# Altium schematic sheet Schema_9_relaiskaart.SchDoc
size A4; SheetNumber: 1; SheetTotal: 1
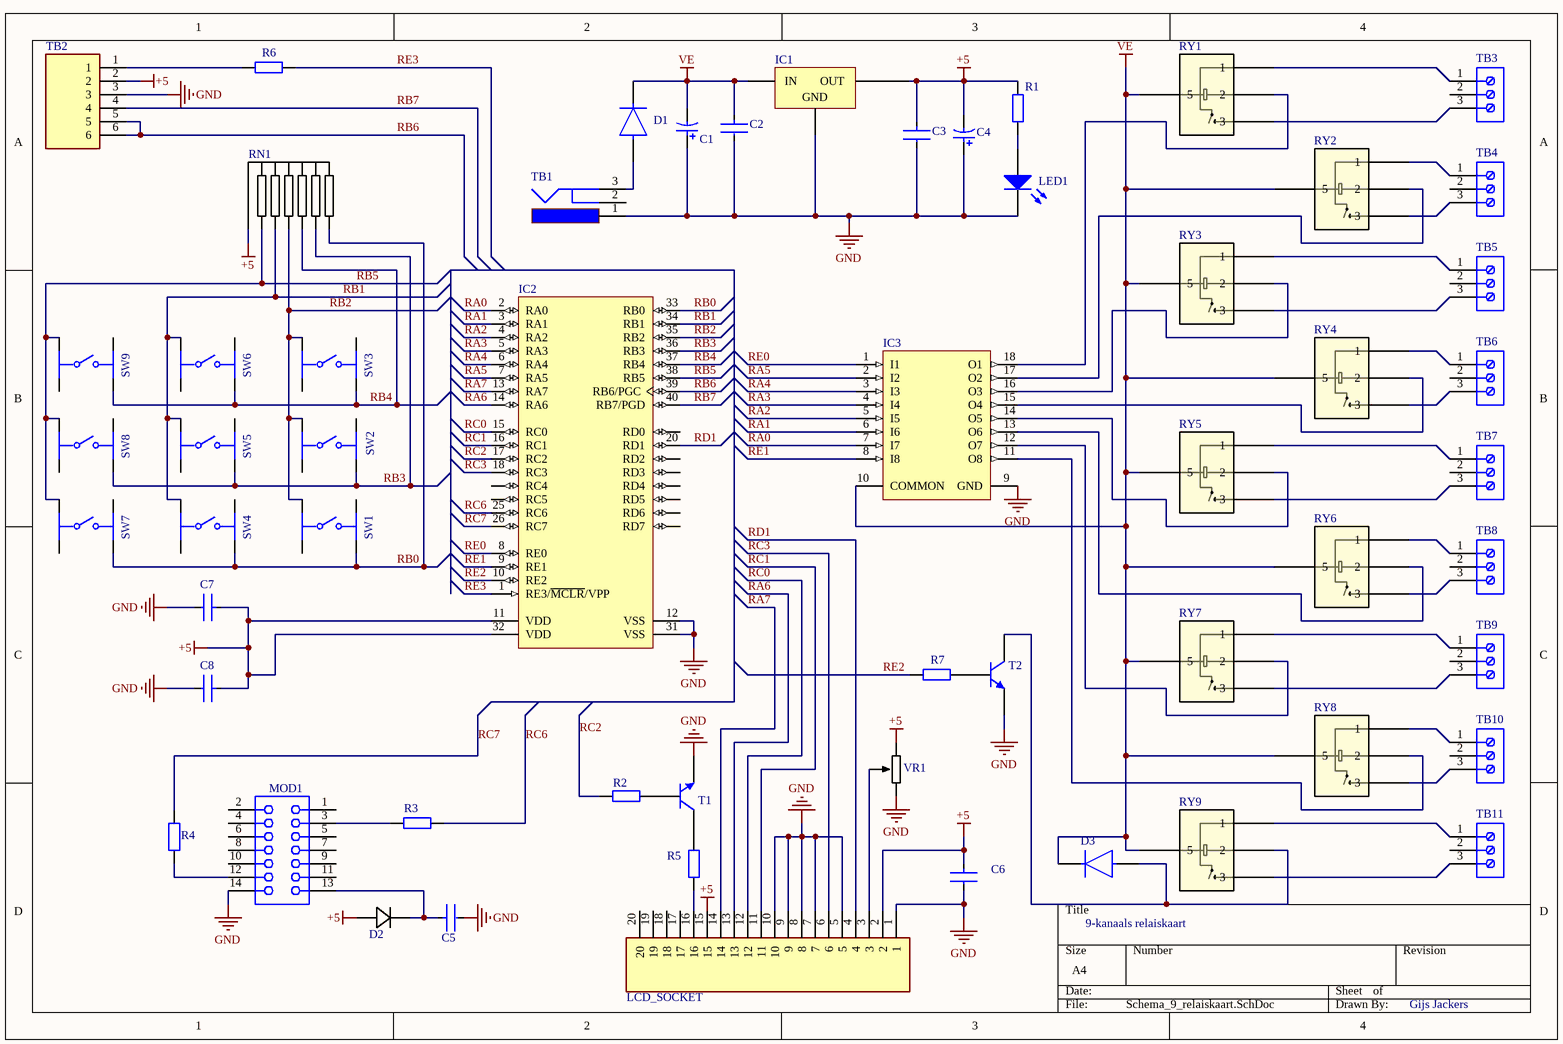
[diagram p0: Schema_9_relaiskaart.SchDoc]

## Parts
C1  ECA-1HM221  [CAPPR65-500-1250X1000X1350]  (value not drawn)
C2  SR205C104KAR  [FP-SR20-MFG]  (value not drawn)
C3  SR205C104KAR  [FP-SR20-MFG]  (value not drawn)
C4  ECA1HM101  [CAPPR65-350-1150X800X1250]  (value not drawn)
C5  SR205C104KAR  [FP-SR20-MFG]  (value not drawn)
C6  SR205C104KAR  [FP-SR20-MFG]  (value not drawn)
C7  SR205C104KAR  [FP-SR20-MFG]  (value not drawn)
C8  SR205C104KAR  [FP-SR20-MFG]  (value not drawn)
D1  1N4007  [FP-1N4007-MFG]  (value not drawn)
D2  BAT43  [DO-35_STM]  (value not drawn)
D3  1N4007  [FP-1N4007-MFG]  (value not drawn)
IC1  MC7805CTG  [ONSC-TO-220-3-221AB-01]  (value not drawn)
IC2  PIC18F45K22-E/P  [MCHP-PDIP-P40]  (value not drawn)
IC3  ULN2803A  [STM-DIP-18]  (value not drawn)
LCD_SOCKET  D01-9972042  [D019972042]  (value not drawn)
LED1  151031SS04000  [Type 3mm]  (value not drawn)
MOD1  ESQ-107-12-G-D  [DIP14]  (value not drawn)
R1  ERJ-8GEYJ331V  [RESC3216X70X50NL05T20]  (value not drawn)
R2  ERJ-8GEYJ472V  [RESC3216X70X50LL05T20]  (value not drawn)
R3  ERJ-8GEYJ102V  [RESC3216X70X50LL05T20]  (value not drawn)
R4  ERJ-8GEYJ102V  [RESC3216X70X50LL05T20]  (value not drawn)
R5  ERJ-8GEYJ4R7V  [RESC3216X70X50NL05T20]  (value not drawn)
R6  ERJ-8GEYJ100V  [RESC3216X70X50LL05T20]  (value not drawn)
R7  ERJ-8GEYJ472V  [RESC3216X70X50LL05T20]  (value not drawn)
RN1  4607X-101-103LF  [BO_4607X]  (value not drawn)
RY1  G5LE-1A-CF DC12  [RELAY_G5LE-1A DC5_OMR]  (value not drawn)
RY2  G5LE-1A-CF DC12  [RELAY_G5LE-1A DC5_OMR]  (value not drawn)
RY3  G5LE-1A-CF DC12  [RELAY_G5LE-1A DC5_OMR]  (value not drawn)
RY4  G5LE-1A-CF DC12  [RELAY_G5LE-1A DC5_OMR]  (value not drawn)
RY5  G5LE-1A-CF DC12  [RELAY_G5LE-1A DC5_OMR]  (value not drawn)
RY6  G5LE-1A-CF DC12  [RELAY_G5LE-1A DC5_OMR]  (value not drawn)
RY7  G5LE-1A-CF DC12  [RELAY_G5LE-1A DC5_OMR]  (value not drawn)
RY8  G5LE-1A-CF DC12  [RELAY_G5LE-1A DC5_OMR]  (value not drawn)
RY9  G5LE-1A-CF DC12  [RELAY_G5LE-1A DC5_OMR]  (value not drawn)
SW1  B3F-4000  [FP-B3F-4000-MFG]  (value not drawn)
SW2  B3F-4000  [FP-B3F-4000-MFG]  (value not drawn)
SW3  B3F-4000  [FP-B3F-4000-MFG]  (value not drawn)
SW4  B3F-4000  [FP-B3F-4000-MFG]  (value not drawn)
SW5  B3F-4000  [FP-B3F-4000-MFG]  (value not drawn)
SW6  B3F-4000  [FP-B3F-4000-MFG]  (value not drawn)
SW7  B3F-4000  [FP-B3F-4000-MFG]  (value not drawn)
SW8  B3F-4000  [FP-B3F-4000-MFG]  (value not drawn)
SW9  B3F-4000  [FP-B3F-4000-MFG]  (value not drawn)
T1  BC337-25ZL1G  [ONSC-TO-92-3-29-11_AM_BL]  (value not drawn)
T2  BC337-25ZL1G  [ONSC-TO-92-3-29-11_AM_BL]  (value not drawn)
TB1  Component_1  [MJ-180PH]  (value not drawn)
TB2  M20-7820646  [HDRV6W70P0X254_1X6_1564X250X865P]  (value not drawn)
TB3  691101710003  [691101710003]  (value not drawn)
TB4  691101710003  [691101710003]  (value not drawn)
TB5  691101710003  [691101710003]  (value not drawn)
TB6  691101710003  [691101710003]  (value not drawn)
TB7  691101710003  [691101710003]  (value not drawn)
TB8  691101710003  [691101710003]  (value not drawn)
TB9  691101710003  [691101710003]  (value not drawn)
TB10  691101710003  [691101710003]  (value not drawn)
TB11  691101710003  [691101710003]  (value not drawn)
VR1  3362P-1-103LF  [BOUR-3362P]  (value not drawn)

## Nets
+5: C3.1 C4.2 C6.1 C7.1 C8.1 D2.1 IC2.11(VDD) IC2.32(VDD) LCD_SOCKET.2 LCD_SOCKET.15 R1.2 RN1.1 TB2.2 VR1.1(CCW)
GND: C1.1 C2.2 C3.2 C4.1 C5.2 C6.2 C7.2 C8.2 IC1.2(GND) IC2.12(VSS) IC2.31(VSS) IC3.9(GND) LCD_SOCKET.1 LCD_SOCKET.5 LCD_SOCKET.7 LCD_SOCKET.8 LCD_SOCKET.9 LCD_SOCKET.10 LED1.1(K) MOD1.14 T1.3(E) T2.3(E) TB1.1 TB2.3 VR1.3(CW)
VE: C1.2 C2.1 D1.1(C) D3.1(C) IC1.1(IN) IC3.10(COMMON) RY1.5 RY2.5 RY3.5 RY4.5 RY5.5 RY6.5 RY7.5 RY8.5 RY9.5
RA0: IC2.2(RA0) IC3.7(I7)
RA1: IC2.3(RA1) IC3.6(I6)
RA2: IC2.4(RA2) IC3.5(I5)
RA3: IC2.5(RA3) IC3.4(I4)
RA4: IC2.6(RA4) IC3.3(I3)
RA5: IC2.7(RA5) IC3.2(I2)
RA6: IC2.14(RA6) LCD_SOCKET.13
RA7: IC2.13(RA7) LCD_SOCKET.14
RB0: IC2.33(RB0) RN1.7 SW1.4 SW4.4 SW7.4
RB1: IC2.34(RB1) RN1.3 SW4.1 SW5.1 SW6.1
RB2: IC2.35(RB2) RN1.4 SW1.1 SW2.1 SW3.1
RB3: IC2.36(RB3) RN1.6 SW2.4 SW5.4 SW8.4
RB4: IC2.37(RB4) RN1.5 SW3.4 SW6.4 SW9.4
RB5: IC2.38(RB5) RN1.2 SW7.1 SW8.1 SW9.1
RB6: IC2.39(RB6/PGC) TB2.5 TB2.6
RB7: IC2.40(RB7/PGD) TB2.4
RC0: IC2.15(RC0) LCD_SOCKET.12
RC1: IC2.16(RC1) LCD_SOCKET.11
RC2: IC2.17(RC2) R2.2
RC3: IC2.18(RC3) LCD_SOCKET.6
RC6: IC2.25(RC6) R3.2
RC7: IC2.26(RC7) R4.2
RD1: IC2.20(RD1) LCD_SOCKET.4
RE0: IC2.8(RE0) IC3.1(I1)
RE1: IC2.9(RE1) IC3.8(I8)
RE2: IC2.10(RE2) R7.1
RE3: IC2.1(RE3/~{MCLR}/VPP) R6.1
NetC5_1: C5.1 D2.2 MOD1.13
NetD1_2: D1.2(A) TB1.3
NetD3_2: D3.2(A) RY9.2 T2.1(C)
NetIC3_11: IC3.11(O8) RY8.2
NetIC3_12: IC3.12(O7) RY7.2
NetIC3_13: IC3.13(O6) RY6.2
NetIC3_14: IC3.14(O5) RY5.2
NetIC3_15: IC3.15(O4) RY4.2
NetIC3_16: IC3.16(O3) RY3.2
NetIC3_17: IC3.17(O2) RY2.2
NetIC3_18: IC3.18(O1) RY1.2
NetLCD_SOCKET_3: LCD_SOCKET.3 VR1.2(S)
NetLCD_SOCKET_16: LCD_SOCKET.16 R5.2
NetLED1_2: LED1.2(A) R1.1
NetMOD1_3: MOD1.3 R3.1
NetMOD1_12: MOD1.12 R4.1
NetR2_1: R2.1 T1.2(B)
NetR5_1: R5.1 T1.1(C)
NetR6_2: R6.2 TB2.1
NetR7_2: R7.2 T2.2(B)
NetRY1_1: RY1.1 TB3.1
NetRY1_3: RY1.3 TB3.3
NetRY2_1: RY2.1 TB4.1
NetRY2_3: RY2.3 TB4.3
NetRY3_1: RY3.1 TB5.1
NetRY3_3: RY3.3 TB5.3
NetRY4_1: RY4.1 TB6.1
NetRY4_3: RY4.3 TB6.3
NetRY5_1: RY5.1 TB7.1
NetRY5_3: RY5.3 TB7.3
NetRY6_1: RY6.1 TB8.1
NetRY6_3: RY6.3 TB8.3
NetRY7_1: RY7.1 TB9.1
NetRY7_3: RY7.3 TB9.3
NetRY8_1: RY8.1 TB10.1
NetRY8_3: RY8.3 TB10.3
NetRY9_1: RY9.1 TB11.1
NetRY9_3: RY9.3 TB11.3

Not connected (* = marked no-connect by the designer): IC1 3(OUT); IC2 19(RD0) 21(RD2) 22(RD3) 23(RC4) 24(RC5) 27(RD4) 28(RD5) 29(RD6) 30(RD7); LCD_SOCKET 17 18 19 20; MOD1 1 2 4 5 6 7 8 9 10 11; SW1 2 3; SW2 2 3; SW3 2 3; SW4 2 3; SW5 2 3; SW6 2 3; SW7 2 3; SW8 2 3; SW9 2 3; TB1 2; TB3 2; TB4 2; TB5 2; TB6 2; TB7 2; TB8 2; TB9 2; TB10 2; TB11 2

## Notes on the sheet
- 9-kanaals relaiskaart
- Gijs Jackers

## Library data of the parts
C1 = CMP-1665-00043-1: Aluminum Electrolytic Capacitor, 220 uF, +/- 20%, 50 V, -40 to 85 degC, 2-Pin THD, RoHS, Bulk; Max Supply Voltage: 5.5 V; Min Supply Voltage: 4.5 V; Propagation Delay: 10 us; Data Rate: 120 kbps; Nominal Supply Current: 10 mA; Case\Package: SOIC; Nominal Supply Voltage: 5 V; Channels: 2; Interface: RS-232; Width: 4 mm; Packaging: Rail/Tube; ComponentLink2Description: Datasheet; Height: 1.5 mm; PackageReference: CAPPR65-500-1250X1000X1350; Pins: 16; DatasheetVersion: Mar-16; Max Operating Temperature: 70 degC; Length: 10 mm; REACH SVHC: No SVHC; ComponentLink1Description: Manufacturer URL; Package Quantity: 50; ComponentLink2URL: http://industrial.panasonic.com/cdbs/www-data/pdf/RDF0000/DMF0000COL68.pdf; ComponentLink1URL: http://www.panasonic.com/; PackageDescription: 2-Pin Radial Lead, Dia 10 mm, Body Length 12.5 mm; Min Operating Temperature: 0 degC; Radiation Hardening: No; RoHSCompliant: true; Mount: Surface Mount
C2 C3 C5-C8 = CMP-04427-000013-1: CAP CER 0.1UF 50V X7R RADIAL; Manufacturer: AVX; Material: Ceramic; Tolerance: 10%; Capacitance: 100nF; Value: 100nF; Voltage: 50V; Height: 5.08mm; Digikey Description: CAP CER 0.1UF 50V X7R RADIAL; Device Class L2: Capacitors; ComponentLink2URL: http://datasheets.avx.com/SR-Series.pdf; Temperature Range High: +125°C; Lead Free: Yes; Manufacturer Part Number: SR205C104KAR; Category: Cap; Device Class L1: Passive Components; Temperature: -55°C to +125°C; Voltage Rating: 50V; ComponentLink2Description: Datasheet; RoHS: TRUE; Automotive: No; Octopart: https://octopart.com/sr205c104kar-avx-145048; Mouser Description: Multilayer Ceramic Capacitors MLCC - Leaded 50volts 0.1uF 10% X7R; Temperature Characteristic: X7R; Device Class L3: Ceramic Capacitors; Temperature Range Low: -55°C; Package: SR20
C4 = CMP-1665-00042-2: Aluminum Electrolytic Capacitor, 100 uF, +/- 20%, 50 V, -40 to 85 degC, 2-Pin THD, RoHS, Bulk; Manufacturer: Panasonic; Lead Diameter: 0.6mm; Dielectric Material: Aluminium; Voltage Rating (DC): 50V; Ripple Current (AC): 250mA; Polarity: Polar; Leakage Current: 3uA; Capacitance: 100uF; Life (Hours): 2000Hour; Lead/Base Style: Straight; Dissipation Factor: 0.12%; Radiation Hardening: No; Height: 11.5mm; Package Quantity: 200; Package Reference: CAPPR65-350-1150X800X1250; Min Operating Temperature: -40degC; Mount: ThroughHole; Package Description: 2-Pin Radial Lead, Dia 8 mm, Height 12.5 mm; Case/Package: Radial; Diameter: 8mm; Voltage Rating: 50V; Length: 11.5mm; REACH SVHC: NoSVHC; Height - Seated (Max): 0.492inch; Datasheet URL: https://industrial.panasonic.com/cdbs/www-data/pdf/RDF0000/ABA0000C1218.pdf; RoHSCompliant: true; Ripple Current: 250mA; Lead Free: LeadFree; Voltage: 50V; Manufacturer URL: http://www.panasonic.com/; Number of Pins: 2; Datasheet Version: Rev. 05, 10/2016; Packaging: Bulk; Termination: Radial; Max Operating Temperature: 85degC; Tolerance: 20%; Lead Pitch: 3.5mm
D1 D3 = CMP-123542-000001-1: Rectifier diode 1000 V 1 A DO-41, ,; Manufacturer: Diotec; Max Surge Forward Current: 27A; Forward Current: 1A; Max Junction Temp: +175°C; Reverse Voltage: 1000V; Value: 15pF; Peak Reverse Current: 5uA; Category: Diode; Temperature Range Low: -50°C; Automotive: No; Temperature: -50°C to +175°C; Lead Free: Yes; ComponentLink2Description: Datasheet; Max Repetitive Reverse Voltage: 1000V; ComponentLink2URL: https://datasheet.octopart.com/1N4007-Diotec-datasheet-62346875.pdf; Manufacturer Part Number: 1N4007; Device Class L3: Rectifier Diodes; Height: 2.8mm; Octopart: https://octopart.com/1n4007-diotec-4040411; Package: 1N4007; Temperature Range High: +175°C; Device Class L1: Discrete Semiconductors; Device Class L2: Diodes; RoHS: TRUE; Capacitance: 15pF; Ipc Land Pattern Name: DIOAD888W100L520D280
D2 = BAT43: No Description Available; Vendor: STMicroelectronics; Built_By: EMA_UL_Team; SourceLibrary: Add_to_database_2021-01-20; Type: DEV; Manufacturer_Part_Number: BAT43; Copyright: Copyright (C) 2018 Accelerated Designs. All rights reserved; RefDes: RefDes
IC1 = CMP-2000-04928-1: Positive Voltage Regulator, 1 A, 5 V, 0 to 125 degC, 3-Pin TO-220, RoHS, Tube; Manufacturer: ON Semiconductor; Resistance, Thermal, Junction to Case: 5degC/W; Voltage, Supply: 35V; Regulator Function: Standard; Temperature, Operating, Maximum: +125degC; Load Regulation: 25mV; Regulator Type: PositiveVoltageOut; Current, Output, Maximum: 1A; Regulation, Load: 1.3mV; Number of Outputs: 1; Temperature, Operating, Range: 0to+125degC; Regulation, Line: 0.5mV; Line Regulation: 20mV; Voltage, Input Range: Maximumof35V; Output Type: Fixed; Current, Quiescent Supply: 6.5mA; Dropout Voltage: 2V; Temperature, Operating, Minimum: 0degC; Package Version: Rev. A, 11/2010; Current, Supply: 3.2mA; Voltage, Output: 5V; Voltage, Noise: 10μV/V; Package Type: TO-220; Voltage, Input, High Level: 35V; Datasheet URL: http://www.onsemi.com/pub_link/Collateral/MC7800-D.PDF; Dimensions: 10.28x4.82x15.75mm; Width: 4.82mm; Type: VoltageRegulator; Mounting Type: ThroughHole; Polarity: Positive; Datasheet Version: Rev. 27, 11/2014; Height: 15.75mm; Dropout Voltage Measurement Current: 1A; Package Description: 3-Pin Flange Mount, Vertical Straight Lead, Body 9.97 x 4.445 mm, Pitch 2.54 mm; Manufacturer URL: http://www.onsemi.com/; Voltage, Dropout: 2V; Length: 10.28mm; Number of Pins: 3; Package Reference: TO-220-3-221AB-01
IC2 = CMP-0116-01375-1: Low-Power, High-Performance Microcontroller with XLP Technology, 64 MHz, 35 I/O, -40 to 125 degC, 40-pin PDIP (P40), Tube; Manufacturer: Microchip; # of A/D Channels: 28; Max. CPU Speed MHz: 64; Operation Voltage Range: 2.3V - 5.5V; Timers: 3 - 8-bit, 4 - 16-bit; EEPROM Data Memory (bytes): 256; Internal Oscillator: 16 MHz, 31 kHz; Digital Communication: 2 -A/E/USART, 2 -MSSP(SPI/I2C); Memory Type: Flash; I/O Pins: 35; Program Memory KBytes: 32; RAM: 1536; Program Memory KWords: 16; ComponentLink1URL: http://ww1.microchip.com/downloads/en/DeviceDoc/41412F.pdf; ComponentLink2Description: Package Specification; Packing: TUBE; PackageReference: PDIP-P40; ComponentLink3Description: URL Link1; RoHS: TRUE; PartNumber: PIC18F45K22-E/P; DatasheetVersion: Rev. F; Mounting Technology: Through Hole; PackageVersion: C04-016B, 04/2013; PackageDescription: 40-Lead Plastic Dual In-Line Package, Body 51.75 x 13.53 mm, Pitch 2.54 mm; ComponentLink1Description: Datasheet; ComponentLink3URL: Product URL:http://www.microchip.com/datasheet/PIC18F45K22; ComponentLink2URL: http://www.microchip.com/stellent/groups/techpub_sg/documents/packagingspec/en012702.pdf
IC3 = CMP-2000-05363-1: Eight Darlington Arrays, 50 V, 2.25 W, 500 mA, 18-Pin DIP, RoHS, Tube; Manufacturer: STMicroelectronics; DC Collector Current: 500mA; DC Current Gain hFE: 1000hFE; SVHC: NoSVHC(17-Dec-2015); Power Dissipation Pd: 2.25W; Transistor Polarity: NPN; Collector Emitter Voltage V(br)ceo: 50V; No. of Pins: 18Pins; Automotive Qualification Standard: -; Package Reference: DIP-18; Manufacturer URL: http://www.st.com/; MSL: -; Operating Temperature Max: 85degC; Datasheet Version: Sep-03; Transistor Case Style: DIP; Package Description: 18-Pin Double In-line Package, Body 24.8 x 7.1 mm, Pitch 2.54 mm; Product Range: -; Datasheet URL: https://datasheet.ciiva.com/29306/171824-da-01-en-ic-uln2803-dil18-29306026.pdf
LCD_SOCKET = D01-9972042: Connector; Manufacturer_Name: Harwin; Datasheet Link: https://componentsearchengine.com//D01-9972042.pdf; Height: 4.25mm; Mouser2 Part Number: 855-D01-9972042; Mouser2 Price/Stock: https://www.mouser.com/Search/Refine.aspx?Keyword=855-D01-9972042; Manufacturer_Part_Number: D01-9972042
LED1 = CMP-1488-00005-1: THT LED round mono-color color lens, WL-TMRW, Super Red; Manufacturer: Wuerth Elektronik; ComponentLink2Description: Datasheet; ComponentLink1URL: http://www.we-online.com; ComponentLink1Description: Manufacturer URL; PackageReference: Type 3mm; PartNumber: 151031SS04000; ComponentLink2URL: http://katalog.we-online.de/pbs/datasheet/7448042001.pdfhttp://katalog.we-online.de/pbs/datasheet/7448042001.pdfhttp://katalog.we-online.de/pbs/datasheet/7448042001.pdfhttp://katalog.we-online.de/pbs/datasheet/151031SS04000.pdf; Emitting color: Super Red
MOD1 = CMP-1026-00022-1: PC/104(TM) Elevated Socket Strip, Through-hole, Vertical, -55 to 125 degC, 2.54 mm Pitch, 14-Pin, Female, RoHS; Manufacturer: Samtec; Pitch: 2.54 mm; Mounting Technology: Through-hole; PackageVersion: BZ, 9/1998; ComponentLink2Description: Datasheet; Temperature Range: -55 to 125 degC; ComponentLink2URL: http://www.samtec.com/documents/webfiles/pdf/ESQ_TH.PDF; ComponentLink3URL: http://www.samtec.com/documents/webfiles/cpdf/ESQ-1XX-XX-X-X-XXX-XX-X-XX-MKT.pdf; ComponentLink3Description: Package Specification; DatasheetVersion: F-214; ComponentLink1Description: Manufacturer URL; PartNumber: ESQ-107-12-G-D; Orientation: Vertical; ComponentLink1URL: http://www.samtec.com; PackageDescription: ESQ Strip ASM; PackageReference: ESQ-107-12-X-D; RoHS: True; Manufacturer Part Number: ESQ-107-12-G-D
R1 = CMP-2003-00612-1: Manufacturer: Panasonic; Part Number: ERJ-8GEYJ331V
R2 R7 = CMP-2003-00636-1: Manufacturer: Panasonic; Part Number: ERJ-8GEYJ472V
R3 R4 = CMP-2003-00544-1: Manufacturer: Panasonic; Part Number: ERJ-8GEYJ102V
R5 = CMP-1014-00018-2: Manufacturer: Panasonic; Part Number: ERJ-8GEYJ4R7V
R6 = CMP-2003-00542-1: Manufacturer: Panasonic; Part Number: ERJ-8GEYJ100V
RN1 = 4607X-101-103LF: No Description Available; Vendor: Bourns Electronics; Built_By: EMA_UL_Team; SourceLibrary: BadPin1FPs_Fixed; Manufacturer_Part_Number: 4607X-101-103LF; Copyright: Copyright (C) 2018 Accelerated Designs. All rights reserved; RefDes: RefDes; Type: DEV
RY1-RY9 = G5LE-1A-CF DC12: No Description Available; Built_By: EMA_Justin; Vendor: Omron; SourceLibrary: Omron_2020-03-12; Copyright: Copyright (C) 2018 Accelerated Designs. All rights reserved; Manufacturer_Part_Number: G5LE-1A-CF DC12; RefDes: RefDes; Type: DEV
SW1-SW9 = CMP-08834-000001-1: SWITCH TACTILE SPST-NO 0.05A 24V; Manufacturer: Omron; Contact Current Rating: 50mA; Contact Resistance: 100mΩ; Operating Force: 1.27N; Electromechanical Life: 3000000Cycles; Digikey Description: SWITCH TACTILE SPST-NO 0.05A 24V; Automotive: No; Manufacturer Part Number: B3F-4000; Temperature Range High: +70°C; Octopart: https://octopart.com/b3f-4000-omron-22510; Mouser Description: Tactile Switches 12x12mm Std Ht 4.3 Gen Purpose 130g; Throw Configuration: SPST-NO; Height: 4.5mm; Voltage Rating Dc: 24V; Temperature: -25°C to +70°C; Device Class L1: Electromechanical; Device Class L2: Switches; Ambient Temperature Range Low: -25°C; Category: Switch; Mount: Through Hole; Device Class L3: Tactile Switches; RoHS: TRUE; ComponentLink2Description: Datasheet; Temperature Range Low: -25°C; Ambient Temperature Range High: +70°C; ComponentLink2URL: https://omronfs.omron.com/en_US/ecb/products/pdf/en-b3f.pdf; Package: B3F-4000; Lead Free: Yes
T1 T2 = CMP-1048-01574-1: Amplifier Transistor, NPN Silicon, 3-Pin TO-92, Pb-Free, Ammo Box; Manufacturer: On Semiconductor; IC Continuous (A): 0.8; PackageDescription: 3-Pin Transistor Outline, Body 4.825 x 3.685 mm, Pitch 1.27 mm; Packing: Ammo Box; Mounting Technology: Through Hole; Polarity: NPN; ComponentLink3Description: Package Specification; DatasheetVersion: Rev. 8; PartNumber: BC337-25ZL1G; RoHS: TRUE; ComponentLink1Description: Manufacturer URL; PackageReference: TO-92-3-29-11_AM_BL; PackageVersion: Rev. AM; ComponentLink2Description: Datasheet; ComponentLink2URL: http://www.onsemi.com/pub_link/Collateral/BC337-D.PDF; ComponentLink3URL: http://www.onsemi.com/pub_link/Collateral/MAC97-D.PDF; ComponentLink1URL: http://www.onsemi.com/
TB2 = M20-7820646: Connector; Manufacturer_Name: Harwin; Datasheet Link: https://componentsearchengine.com//M20-7820646.pdf; Height: 8.65mm; Mouser2 Part Number: 855-M20-7820646; Mouser2 Price/Stock: https://www.mouser.com/Search/Refine.aspx?Keyword=855-M20-7820646; Manufacturer_Part_Number: M20-7820646
TB3-TB11 = CMP-1502-03257-1: Series 101 - 5.00 mm Horizontal Entry Modular with Pressure Clamp WR-TBL, 3 pin; Manufacturer: Wurth Elektronik; Pitch: 5.00mm; Pin Number: 3; Publisher: WurthElektronik; Part Number: 691101710003; Operating Temperature: -40to105degC; Package Reference: 691101710003; Packaging: Box; Manufacturer URL: http://www.we-online.de; Datasheet URL: http://katalog.we-online.de/em/datasheet/6911017100xx.pdf; Mounting Technology: THT
VR1 = CMP-1747-00004-1: Square Trimpot(R) Trimming Potentiometer, 10 KOhm, 300 V, -55 to 125 degC, 3-Pin THD, RoHS, Tube; Manufacturer: Bourns; Voltage Rating: 220 mV; Power Rating: 1 W; Tolerance: 1%; Resistance: 50 mohm; Case/Package: 1206; Length: 3.2 mm; RoHSCompliant: True; PackageDescription: 3-Pin Through Hole Device, Body 6.6 x 6.99 mm, Pitch 2.54 mm; ComponentLink2Description: Datasheet; REACH SVHC: No SVHC; Mount: Surface Mount; Height: 0.6 mm; Packaging: Tape and Reel; ComponentLink1URL: http://www.bourns.com/; Case Code (Imperial): 0612; Pins: 2; Case Code (Metric): 1632; ComponentLink2URL: http://www.bourns.com/docs/Product-Datasheets/3362.pdf; Min Operating Temperature: -25degC; ComponentLink1Description: Manufacturer URL; PackageReference: 3326P; Max Operating Temperature: 125degC; Width: 1.6 mm; Package Quantity: 5000; DatasheetVersion: May-16; Manufacturer Part Number: 3362P-1-103LF